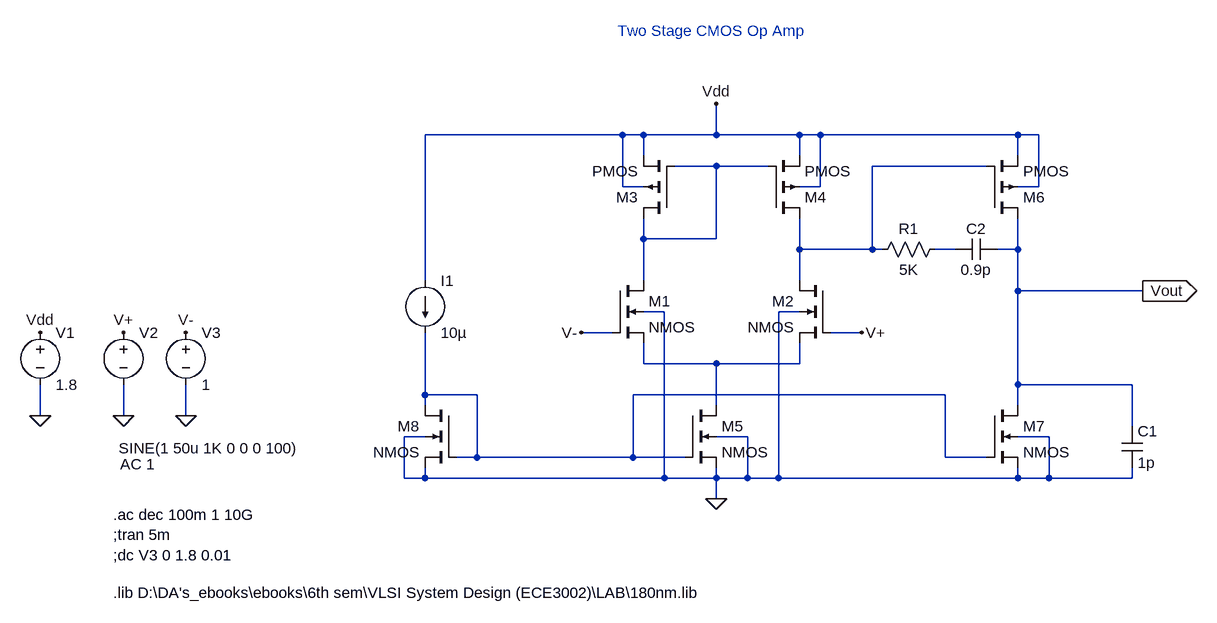
[diagram p0: schematic Two_Stage_CMOS_Op_Amp_1.asc]
Two_Stage_CMOS_Op_Amp_1.asc, the LTspice schematic file:
Version 4
SHEET 1 1104 864
WIRE 192 -96 -112 -96
WIRE 224 -96 192 -96
WIRE 336 -96 336 -144
WIRE 336 -96 224 -96
WIRE 464 -96 336 -96
WIRE 496 -96 464 -96
WIRE 800 -96 496 -96
WIRE 832 -96 800 -96
WIRE 224 -64 224 -96
WIRE 464 -64 464 -96
WIRE 800 -64 800 -96
WIRE 336 -48 272 -48
WIRE 416 -48 336 -48
WIRE 752 -48 576 -48
WIRE 192 -16 192 -96
WIRE 224 -16 192 -16
WIRE 496 -16 496 -96
WIRE 496 -16 464 -16
WIRE 832 -16 832 -96
WIRE 832 -16 800 -16
WIRE 224 64 224 32
WIRE 336 64 336 -48
WIRE 336 64 224 64
WIRE 464 80 464 32
WIRE 576 80 576 -48
WIRE 576 80 464 80
WIRE 592 80 576 80
WIRE 704 80 672 80
WIRE 800 80 800 32
WIRE 800 80 768 80
WIRE -112 128 -112 -96
WIRE 224 128 224 64
WIRE 464 128 464 80
WIRE 800 144 800 80
WIRE 992 144 800 144
WIRE 256 176 224 176
WIRE 464 176 432 176
WIRE 176 208 128 208
WIRE 560 208 512 208
WIRE 224 256 224 224
WIRE 336 256 224 256
WIRE 464 256 464 224
WIRE 464 256 336 256
WIRE 800 288 800 144
WIRE 976 288 800 288
WIRE -112 304 -112 208
WIRE -32 304 -112 304
WIRE 688 304 208 304
WIRE -112 320 -112 304
WIRE 336 320 336 256
WIRE 800 320 800 288
WIRE -704 336 -704 288
WIRE -576 336 -576 288
WIRE -480 336 -480 288
WIRE 976 352 976 288
WIRE -112 368 -144 368
WIRE 384 368 336 368
WIRE 848 368 800 368
WIRE -32 400 -32 304
WIRE -32 400 -64 400
WIRE 208 400 208 304
WIRE 208 400 -32 400
WIRE 288 400 208 400
WIRE 688 400 688 304
WIRE 752 400 688 400
WIRE -144 432 -144 368
WIRE -112 432 -112 416
WIRE -112 432 -144 432
WIRE 256 432 256 176
WIRE 256 432 -112 432
WIRE 336 432 336 416
WIRE 336 432 256 432
WIRE 384 432 384 368
WIRE 384 432 336 432
WIRE 432 432 432 176
WIRE 432 432 384 432
WIRE 800 432 800 416
WIRE 800 432 432 432
WIRE 848 432 848 368
WIRE 848 432 800 432
WIRE 976 432 976 416
WIRE 976 432 848 432
WIRE 336 464 336 432
FLAG -704 336 0
FLAG 336 464 0
FLAG -704 208 Vdd
FLAG 336 -144 Vdd
FLAG -576 336 0
FLAG -576 208 V+
FLAG -480 336 0
FLAG -480 208 V-
FLAG 560 208 V+
FLAG 128 208 V-
FLAG 992 144 Vout
IOPIN 992 144 Out
DATAFLAG -32 304 ""
DATAFLAG 304 256 ""
DATAFLAG 272 64 ""
DATAFLAG 496 80 ""
DATAFLAG 544 208 ""
DATAFLAG 160 208 ""
DATAFLAG 848 144 ""
DATAFLAG 368 -96 ""
SYMBOL nmos4 176 128 R0
SYMATTR InstName M1
SYMATTR Value2 l=1u w=20u
SYMBOL nmos4 512 128 M0
SYMATTR InstName M2
SYMATTR Value2 l=1u w=20u
SYMBOL pmos4 272 32 R180
SYMATTR InstName M3
SYMATTR Value2 l=1u w=50u
SYMBOL pmos4 416 32 M180
SYMATTR InstName M4
SYMATTR Value2 l=1u w=50u
SYMBOL nmos4 288 320 R0
SYMATTR InstName M5
SYMATTR Value2 l=1u w=39u
SYMBOL pmos4 752 32 M180
SYMATTR InstName M6
SYMATTR Value2 l=180n w=37u
SYMBOL nmos4 752 320 R0
SYMATTR InstName M7
SYMATTR Value2 l=1u w=30u
SYMBOL nmos4 -64 320 M0
SYMATTR InstName M8
SYMATTR Value2 l=1u w=10u
SYMBOL voltage -704 192 R0
WINDOW 123 0 0 Left 0
WINDOW 39 0 0 Left 0
SYMATTR InstName V1
SYMATTR Value 1.8
SYMBOL current -112 128 R0
WINDOW 123 0 0 Left 0
WINDOW 39 0 0 Left 0
SYMATTR InstName I1
SYMATTR Value 10µ
SYMBOL cap 960 352 R0
SYMATTR InstName C1
SYMATTR Value 1p
SYMBOL cap 768 64 R90
WINDOW 0 0 32 VBottom 2
WINDOW 3 32 32 VTop 2
SYMATTR InstName C2
SYMATTR Value 0.9p
SYMBOL voltage -576 192 R0
WINDOW 3 -7 194 Left 2
WINDOW 123 -5 219 Left 2
WINDOW 39 0 0 Left 0
SYMATTR Value SINE(1 50u 1K 0 0 0 100)
SYMATTR Value2 AC 1
SYMATTR InstName V2
SYMBOL voltage -480 192 R0
WINDOW 123 0 0 Left 0
WINDOW 39 0 0 Left 0
SYMATTR InstName V3
SYMATTR Value 1
SYMBOL res 688 64 R90
WINDOW 0 0 56 VBottom 2
WINDOW 3 32 56 VTop 2
SYMATTR InstName R1
SYMATTR Value 5K
TEXT -592 608 Left 2 !.lib D:\\DA's_ebooks\\ebooks\\6th sem\\VLSI System Design (ECE3002)\\LAB\\180nm.lib
TEXT -592 488 Left 2 !.ac dec 100m 1 10G\n;tran 5m\n;dc V3 0 1.8 0.01
TEXT 184 -256 Left 2 ;Two Stage CMOS Op Amp

The netlist it stands for:
* Two_Stage_CMOS_Op_Amp_1.asc
M1 N001 V- N004 0 NMOS l=1u w=20u
M2 N002 V+ N004 0 NMOS l=1u w=20u
M3 N001 N001 Vdd Vdd PMOS l=1u w=50u
M4 N002 N001 Vdd Vdd PMOS l=1u w=50u
M5 N004 N005 0 0 NMOS l=1u w=39u
M6 Vout N002 Vdd Vdd PMOS l=180n w=37u
M7 Vout N005 0 0 NMOS l=1u w=30u
M8 N005 N005 0 0 NMOS l=1u w=10u
V1 Vdd 0 1.8
I1 Vdd N005 10µ
C1 Vout 0 1p
C2 Vout N003 0.9p
V2 V+ 0 SINE(1 50u 1K 0 0 0 100) AC 1
V3 V- 0 1
R1 N003 N002 5K
.model NMOS NMOS
.model PMOS PMOS
.lib standard.mos
.lib D:\DA's_ebooks\ebooks\6th sem\VLSI System Design (ECE3002)\LAB\180nm.lib
.ac dec 100m 1 10G
;tran 5m
;dc V3 0 1.8 0.01
* Two Stage CMOS Op Amp
.backanno
.end